# EAGLE design mems_quart_board_SPH0645LM4H-B (EAGLE 7.6.0)
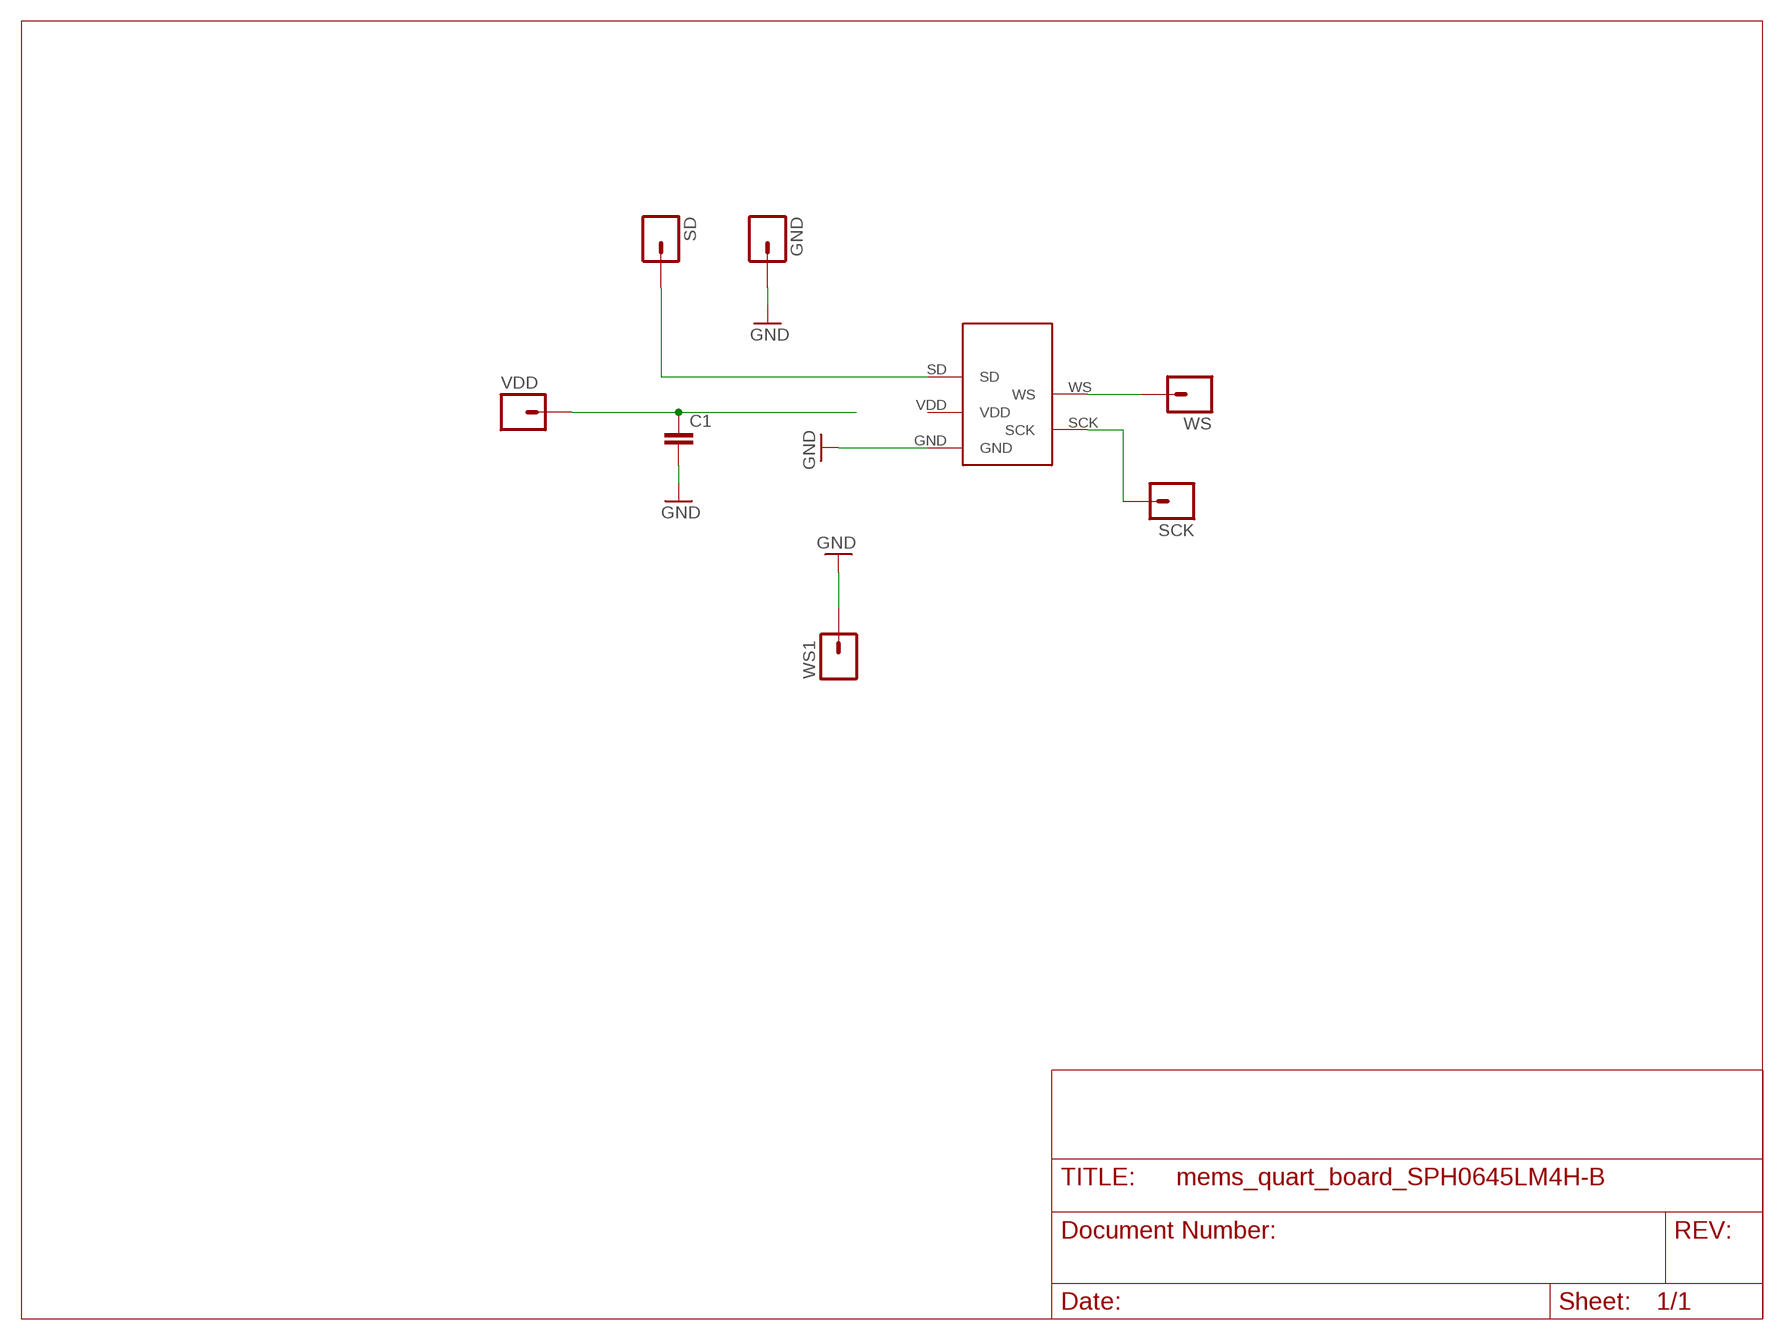
[diagram p0: schematic, sheet 1]

## Parts
C1  0.1UF-16V(+-10%)(0402)  [0402-CAP]
GND  M01PTH_NO_SILK_YES_STOP  [1X01_NO_SILK]
SCK  M01NOSILK-KIT  [1X01NS-KIT]
SD  M01NOSILK-KIT  [1X01NS-KIT]
U$2  MEM_SPH0645LM4H-B  [MEMS_SPH0645LM4H-B]
VDD  M01NOSILK-KIT  [1X01NS-KIT]
WS  M01NOSILK-KIT  [1X01NS-KIT]
WS1  M01NOSILK-KIT  [1X01NS-KIT]

## Nets
GND: C1.2 GND.1 U$2.GND WS1.1
N$1: SCK.1 U$2.SCK
N$2: SD.1 U$2.SD
N$3: U$2.WS WS.1
VDD: C1.1 VDD.1

## Power pins joined to a net without a drawn wire
VDD: U$2.VDD

## Library data of the parts
C1 = SparkFun-Capacitors:0.1UF-16V(+-10%)(0402); PROD_ID: CAP-12416; VALUE: 0.1uF
GND = CM-SparkFun-Connectors-2:M01: Header 1 Standard 1-pin 0.1" header. Use with straight break away headers (SKU : PRT-00116), right angle break away headers (PRT-00553), swiss pins (PRT-00743), machine pins (PRT-00117), and female headers (PRT-00115). SMTSO-256-ET is a "flush mount" nut for a 4-40 screw. The older package used to be too tight, and did not allow it to sit properly thru the drill hit. The latest (0.165DIA) fits nice and snug.
SCK SD VDD WS WS1 = CM-SparkFun-Connectors:M01: Header 1 Standard 1-pin 0.1" header. Use with straight break away headers (SKU : PRT-00116), right angle break away headers (PRT-00553), swiss pins (PRT-00743), machine pins (PRT-00117), and female headers (PRT-00115). SMTSO-256-ET is a "flush mount" nut for a 4-40 screw. The older package used to be too tight, and did not allow it to sit properly thru the drill hit. The latest (0.165DIA) fits nice and snug.
U$2 = mems_knowles_SPH0645LM4H-B:MEM_SPH0645LM4H-B

## Net classes
0 default: clearance 0.205 mm

## Board
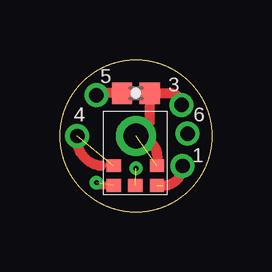
[diagram p1: board, top side]
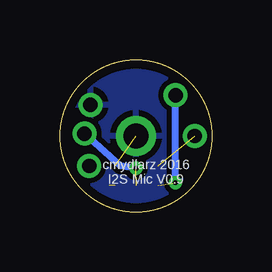
[diagram p2: board, bottom side, seen from below]

Size 6.35 x 6.35 mm. Coordinates in mm from the lower left corner, seen from the top.
Outline: circle at 3.17,3.17 radius 3.17
Copper layers (1*16): Top 0.0356mm / dielectric 1.5011mm / Bottom 0.0356mm
Design rules "oshpark-2layer *": minimum track width 6mil, minimum drill 13mil, track to track 6mil, track to pad 6mil, pad to pad 6mil, via to via 6mil, smd to smd 6mil, copper to edge 15mil, drill to drill 6mil, minimum pad ring 7mil, minimum via ring 7mil, stop-mask expansion 0mil, vias tented up to drill 20mil, thermal gap 10mil

### Footprints (pad centres in the part's own frame; a part is rotated, then mirrored left to right if it is on the bottom)
0402-CAP = smd 0.85 x 0.9: 1 -0.58,0; 2 0.58,0
1X01_NO_SILK = drill 1.05 pad 1.65: 1 0,0
1X01NS-KIT = drill 0.6 pad 1: 1 0,0
MEMS_SPH0645LM4H-B = smd 0.6 x 0.522: GND 2.225,1.208; SCK 0.425,1.208; SD 1.325,0.386; VDD 0.425,0.386; WS 2.225,0.386

### Placement (x,y rotation side)
C1  3.17,4.95 0 top
GND  3.17,3.17 0 top
SCK  0.72,3.17 180 top
SD  5.33,3.27 90 top
U$2  1.83,0.72 0 top
VDD  1.52,4.87 0 top
WS  5.12,1.92 0 top
WS1  5.08,4.48 0 top

### Tracks (layer width: path | path; a pad name or v marks a point on that pad's centre or on a via)
GND  (1 unrouted)
  Top 0.406: WS1.1 arc90 4.59,4.95 C1.2 3.75,3.75 GND.1 arc-90 4.08,2.27
  pour Bottom: 1.08,5.98 arc-28 1.58,6.27 arc13 2.27,6.58 arc-31 2.67,6.67 arc-7 3.87,6.58 arc-34 5.37,5.87 arc-25 6.37,4.48 arc-20 6.67,3.17 arc-27 6.48,2.08 arc-6 5.98,1.08 arc-31 5.17,0.27 arc-10 4.08,-0.23 arc-39 2.37,-0.23 arc-11 0.88,0.47 arc-29 0.58,0.77 arc-1 -0.12,1.98 arc-43 -0.33,3.37 arc-1 -0.03,4.58 arc-45
N$1  (1 unrouted)
  Top 0.406: 1.73,1.92 arc-90 SCK.1
N$2  (via drill 0.2)  (1 unrouted)
  Bottom 0.3: v3.17,1.83 3.83,1.92 SD.1
N$3  (1 unrouted)
  Top 0.406: 4.3,1.1 arc90 WS.1
VDD  (via drill 0.2)  (1 unrouted)
  Top 0.305: 2.27,1.1 1.65,1.1 arc-90 v1.52,1.23
  Top 0.406: C1.1 1.6,4.95 arc90 VDD.1
  Bottom 0.3: v1.52,1.23 VDD.1

### Text on the board
tNames: 5 | 3 | 4 | 6 | 1
bNames: cmydlarz 2016 / I2S Mic V0.9